# EAGLE design ReceiverBoardSchematic (EAGLE 9.4.2)
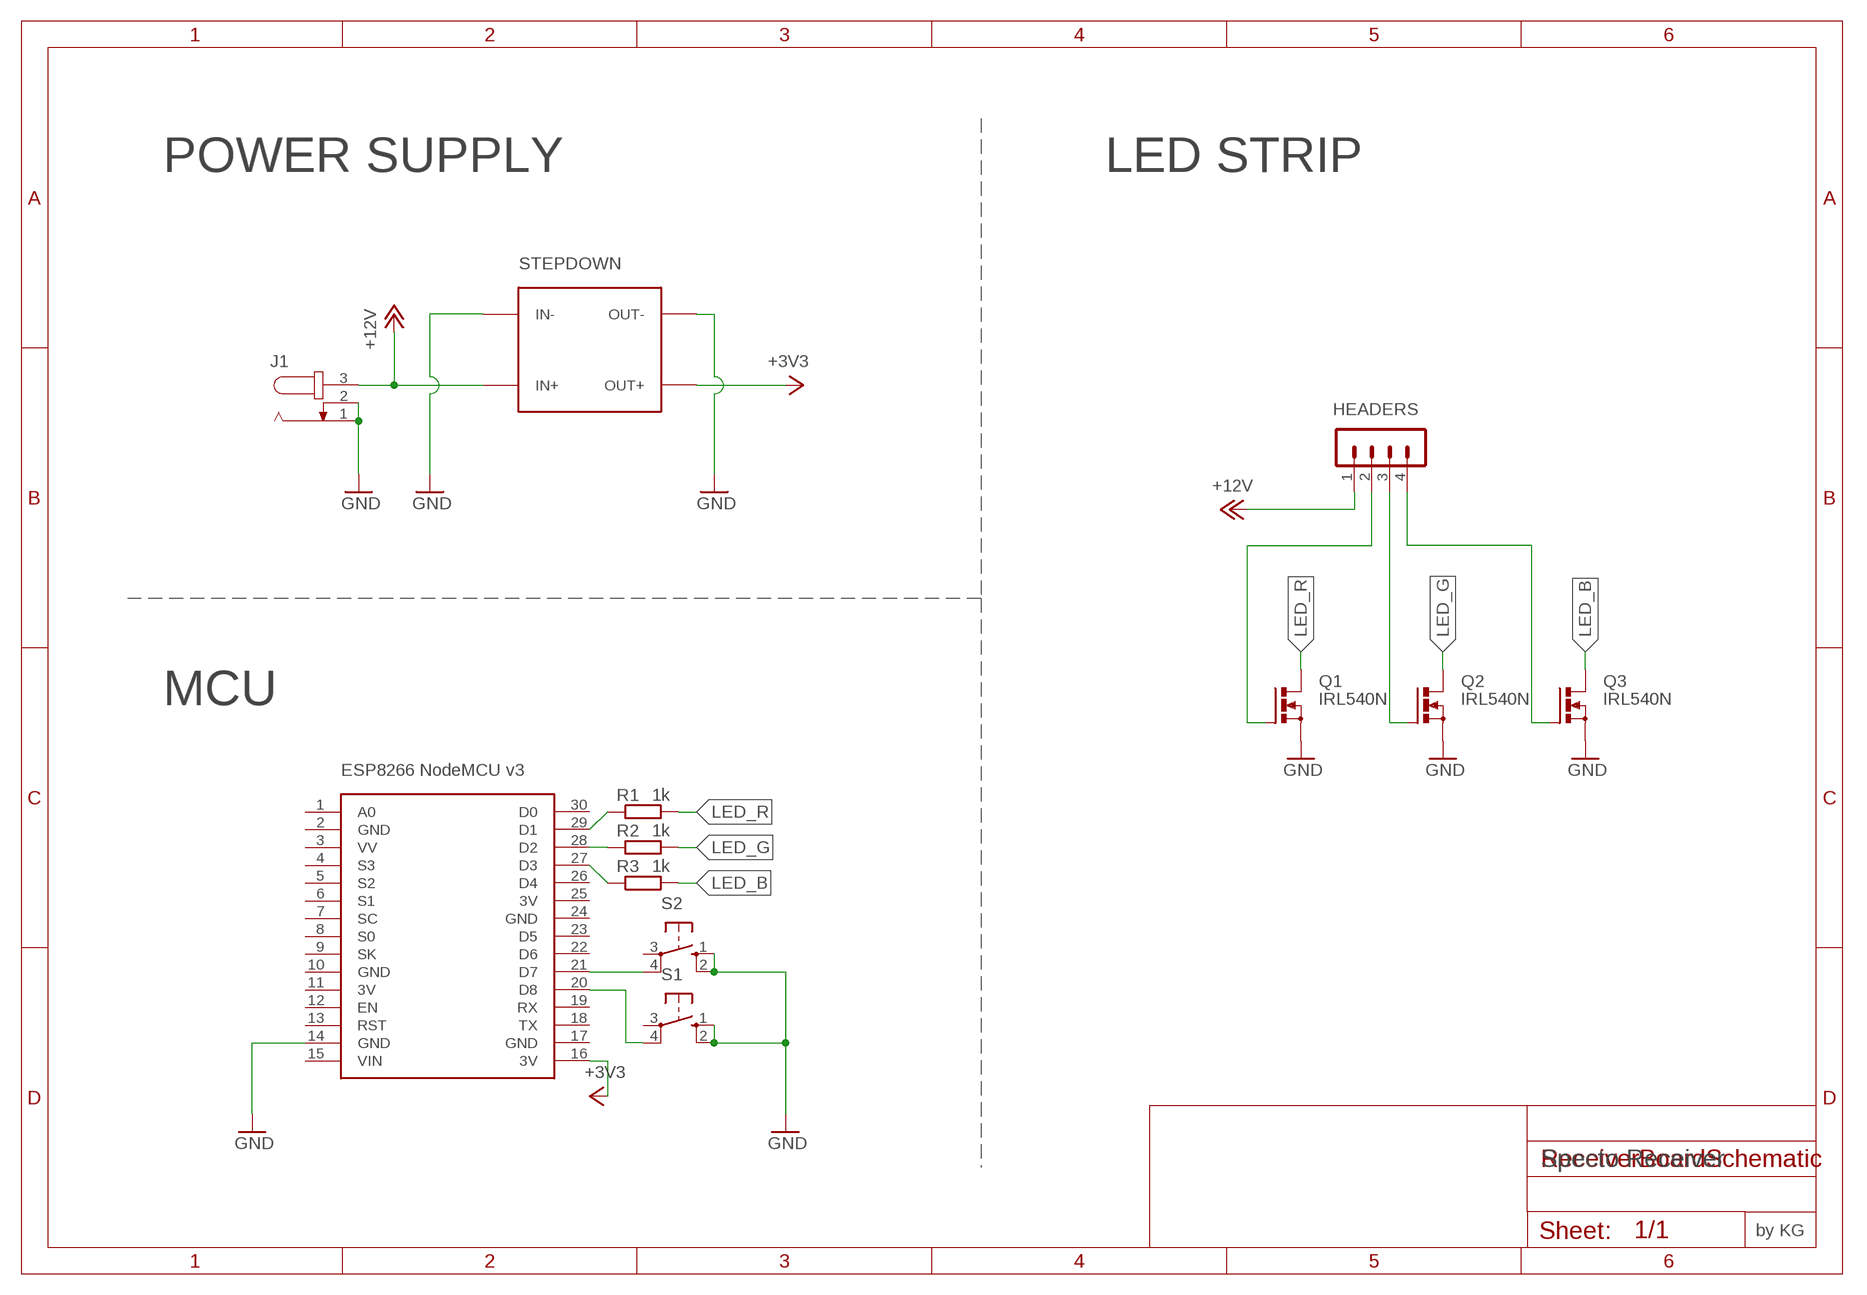
[diagram p0: schematic, sheet 1]

## Parts
ESP2866  NODEMCU  [NODEMCU]
HEADERS  MA04-1  [MA04-1]
J1  JACK-PLUG1  [SPC4078]
Q1  IRL540N  IRF512  [TO220BV]
Q2  IRL540N  IRF512  [TO220BV]
Q3  IRL540N  IRF512  [TO220BV]
R1  1k  R-EU_0309/12  [0309/12]
R2  1k  R-EU_0309/12  [0309/12]
R3  1k  R-EU_0309/12  [0309/12]
S1  10-XX  [B3F-10XX]
S2  10-XX  [B3F-10XX]
STEPDOWN  DC-DC-STEP-DOWN-MP2307  [DC-DC-STEP-DOWN-MP2307]

## Nets
+3V3: ESP2866.16(3V) STEPDOWN.OUT+
+12V: HEADERS.1 J1.3 STEPDOWN.IN+
GND: ESP2866.14(GND) J1.1 J1.2 Q1.S Q2.S Q3.S S1.1(S) S1.2(S1) S2.1(S) S2.2(S1) STEPDOWN.IN- STEPDOWN.OUT-
LED_B: Q3.D R3.2
LED_G: Q2.D R2.2
LED_R: Q1.D R1.2
N$1: HEADERS.2 Q1.G
N$2: HEADERS.3 Q2.G
N$3: HEADERS.4 Q3.G
N$4: ESP2866.29(D1) R1.1
N$5: ESP2866.28(D2) R2.1
N$6: ESP2866.27(D3) R3.1
N$7: ESP2866.21(D7) S2.4(P1)
S1: ESP2866.20(D8) S1.4(P1)
Unconnected: ESP2866.1(A0) ESP2866.3(VV) ESP2866.4(S3) ESP2866.5(S2) ESP2866.6(S1) ESP2866.7(SC) ESP2866.8(S0) ESP2866.9(SK) ESP2866.12(EN) ESP2866.13(RST) ESP2866.15(VIN) ESP2866.18(TX) ESP2866.19(RX) ESP2866.22(D6) ESP2866.23(D5) ESP2866.26(D4) ESP2866.30(D0) S1.3(P) S2.3(P)

## Notes on the sheet
- POWER SUPPLY | LED STRIP
- MCU
- ESP8266 NodeMCU v3
- Specto Receiver
- by KG

## Power pins joined to a net without a drawn wire
3V: ESP2866.11(3V) ESP2866.25(3V)
GND: ESP2866.2(GND) ESP2866.10(GND) ESP2866.17(GND) ESP2866.24(GND)

## Library data of the parts
ESP2866 = nodemcu:NODEMCU
HEADERS = con-lstb:MA04-1: PIN HEADER; OC_FARNELL: unknown; OC_NEWARK: unknown
J1 = con-jack:JACK-PLUG: DC POWER JACK Power Jack, DC, Right Angle, Through Hole, Rated 5A at 16VDC, PC Terminals Distributor: Farnell (www.Farnell.de) Drawing: 84N1161.pdf / 84N1162.pdf Manufacturer: SPC Technology (www.spctechnology.com) Type: SPC4077 / SPC 4078; OC_FARNELL: unknown; OC_NEWARK: unknown
Q1-Q3 = transistor-power:IRF512: N-CHANNEL MOS FET
R1-R3 = rcl:R-EU_: RESISTOR, European symbol; SPICEPREFIX: R
S1 S2 = switch-omron:10-XX: OMRON SWITCH; MPN: B3F-1000; OC_FARNELL: 176432; OC_NEWARK: 36M3542
STEPDOWN = diy-modules:DC-DC-STEP-DOWN-MP2307: DC/DC Step-Down Regulator based on MP2307DN chip MP2307 datasheet available here: https://cdn-shop.adafruit.com/datasheets/MP2307_r1.9.pdf Click here to find device on ebay.com <http://www.ebay.com/sch/dc+dc+3a+mini+converter>

## Board
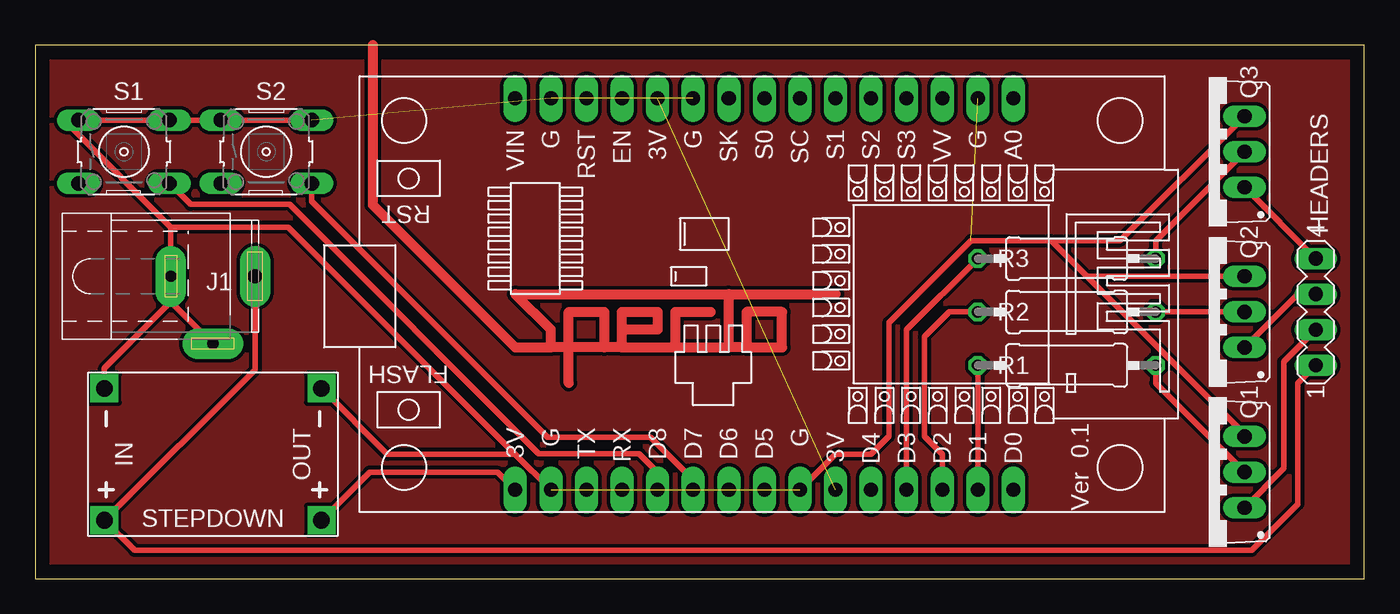
[diagram p1: board, top side]

Size 94.92 x 38.09 mm. Coordinates in mm from the lower left corner, seen from the top.
Outline: 0,0 94.92,0 94.92,38.09 0,38.09 0,0
Copper layers (1*16): Top 0.035mm / dielectric 1.5mm / Bottom 0.035mm
Design rules "default *": minimum track width 16mil, minimum drill 0.35mm, track to track 10mil, track to pad 6mil, pad to pad 6mil, via to via 6mil, smd to smd 6mil, copper to edge 40mil, drill to drill 6mil, minimum pad ring 10mil, minimum via ring 8mil, stop-mask expansion 4mil, vias tented up to drill 0mil, thermal gap 10mil

### Footprints (pad centres in the part's own frame; a part is rotated, then mirrored left to right if it is on the bottom)
NODEMCU = drill 1 pad 1.676 long: 1 -13.97,17.78; 2 -13.97,15.24; 3 -13.97,12.7; 4 -13.97,10.16; 5 -13.97,7.62; 6 -13.97,5.08; 7 -13.97,2.54; 8 -13.97,0; 9 -13.97,-2.54; 10 -13.97,-5.08; 11 -13.97,-7.62; 12 -13.97,-10.16; 13 -13.97,-12.7; 14 -13.97,-15.24; 15 -13.97,-17.78; 16 13.97,-17.78; 17 13.97,-15.24; 18 13.97,-12.7; 19 13.97,-10.16; 20 13.97,-7.62; 21 13.97,-5.08; 22 13.97,-2.54; 23 13.97,0; 24 13.97,2.54; 25 13.97,5.08; 26 13.97,7.62; 27 13.97,10.16; 28 13.97,12.7; 29 13.97,15.24; 30 13.97,17.78
MA04-1 = drill 1.016 long: 1 -3.81,0; 2 -1.27,0; 3 1.27,0; 4 3.81,0
SPC4078 = drill 0.8 pad 2.184 long: 1 -3,0; 2 0,-4.8 | drill 1 pad 2.184 long: 3 3,0
TO220BV = drill 1.016 long: D 0,-2.54; G -2.54,-2.54; S 2.54,-2.54
0309/12 = drill 0.813 octagon: 1 -6.35,0; 2 6.35,0
B3F-10XX = drill 1.016 long: 1 -3.251,2.261; 2 3.251,2.261; 3 -3.251,-2.261; 4 3.251,-2.261
DC-DC-STEP-DOWN-MP2307 = drill 1.2 pad 2 square: IN+ -7.747,-4.699; IN- -7.747,4.699; OUT+ 7.747,-4.699; OUT- 7.747,4.699

### Placement (x,y rotation side)
ESP2866  52.07,20.32 270 top
HEADERS  91.44,19.05 90 top
J1  12.7,21.59 0 top
Q1  83.82,7.62 90 top
Q2  83.82,19.05 90 top
Q3  83.82,30.48 90 top
R1  73.66,15.24 0 top
R2  73.66,19.05 0 top
R3  73.66,22.86 0 top
S1  6.35,30.48 0 top
S2  16.51,30.48 0 top
STEPDOWN  12.7,8.89 0 top

### Tracks (layer width: path | path; a pad name or v marks a point on that pad's centre or on a via)
3V  (1 unrouted)
+3V3
  Top 0.406: ESP2866.16 33.02,7.62 23.88,7.62 STEPDOWN.OUT+
+12V
  Top 0.406: HEADERS.1 90.17,13.97 90.17,5.33 86.87,2.03 7.11,2.03 STEPDOWN.IN+ 15.7,14.94 J1.3
GND  (4 unrouted)
  Top 0.406: ESP2866.24 57.15,8.89 59.69,8.89 60.96,10.16 60.96,18.29 66.8,24.13 72.56,24.13 | Q3.S 77.47,24.13 72.56,24.13 | Q1.S 86.36,10.33 75.1,21.59 | 75.1,21.59 72.56,24.13 | Q2.S 75.1,21.59 | 9.7,25.11 2.58,32.22 S1.1 S1.2 S2.1 S2.2 | 9.7,25.11 18.07,25.11 34.29,8.89 | ESP2866.17 34.29,8.89 | 12.7,16.76 J1.2 12.67,16.79 9.7,19.76 | 9.7,19.76 J1.1 9.7,25.11 | STEPDOWN.OUT- 25.15,8.89 34.29,8.89 | STEPDOWN.IN- 4.95,15.02 9.7,19.76
LED_B
  Top 0.406: R3.2 80.01,24.13 Q3.D
LED_G
  Top 0.406: R2.2 Q2.D
LED_R
  Top 0.406: R1.2 80.01,13.97 Q1.D
N$1
  Top 0.406: Q1.G 89.15,7.87 89.15,15.49 HEADERS.2
N$2
  Top 0.406: Q2.G 90.17,20.32 HEADERS.3
N$3
  Top 0.406: HEADERS.4 Q3.G
N$4
  Top 0.406: R1.1 ESP2866.29
N$5
  Top 0.406: ESP2866.28 64.77,8.89 63.5,10.16 63.5,17.27 65.28,19.05 R2.1
N$6
  Top 0.406: ESP2866.27 62.23,17.78 R3.1
N$7
  Top 0.406: S2.4 19.76,26.95 36.6,10.11 43.96,10.11 46.99,7.08 ESP2866.21
S1
  Top 0.406: ESP2866.20 44.45,7.62 43.13,8.94 35.97,8.94 18.19,26.72 11.1,26.72 S1.4
SPECTO
  pour Top (isolate 0.406): 0,38.1 95.25,38.1 95.25,0 0,0
  pour Top: 0.25,37.85 94.74,37.85 94.74,-0.25 0.25,-0.25
TEXT
  Top 0.711: 36.83,16.51 34.29,16.51 24.13,26.67 24.13,38.1 | 36.83,16.51 36.83,17.78 34.29,20.32 49.53,20.32 | 38.1,13.97 38.1,16.51 | 41.91,16.51 40.64,16.51 | 40.64,16.51 38.1,16.51 | 41.91,16.51 45.72,16.51 | 41.91,16.51 41.91,17.78 | 41.91,17.78 41.91,19.05 44.45,19.05 44.45,17.78 41.91,17.78 | 45.72,16.51 45.72,19.05 48.26,19.05 | 45.72,16.51 49.53,16.51 | 50.8,16.51 49.53,16.51 | 49.53,16.51 49.53,20.32 | 49.53,20.32 57.15,20.32 | 50.8,16.51 50.8,19.05 53.34,19.05 53.34,16.51 50.8,16.51 | 38.1,16.51 36.83,16.51 | 38.1,16.51 38.1,19.05 40.64,19.05 40.64,16.51